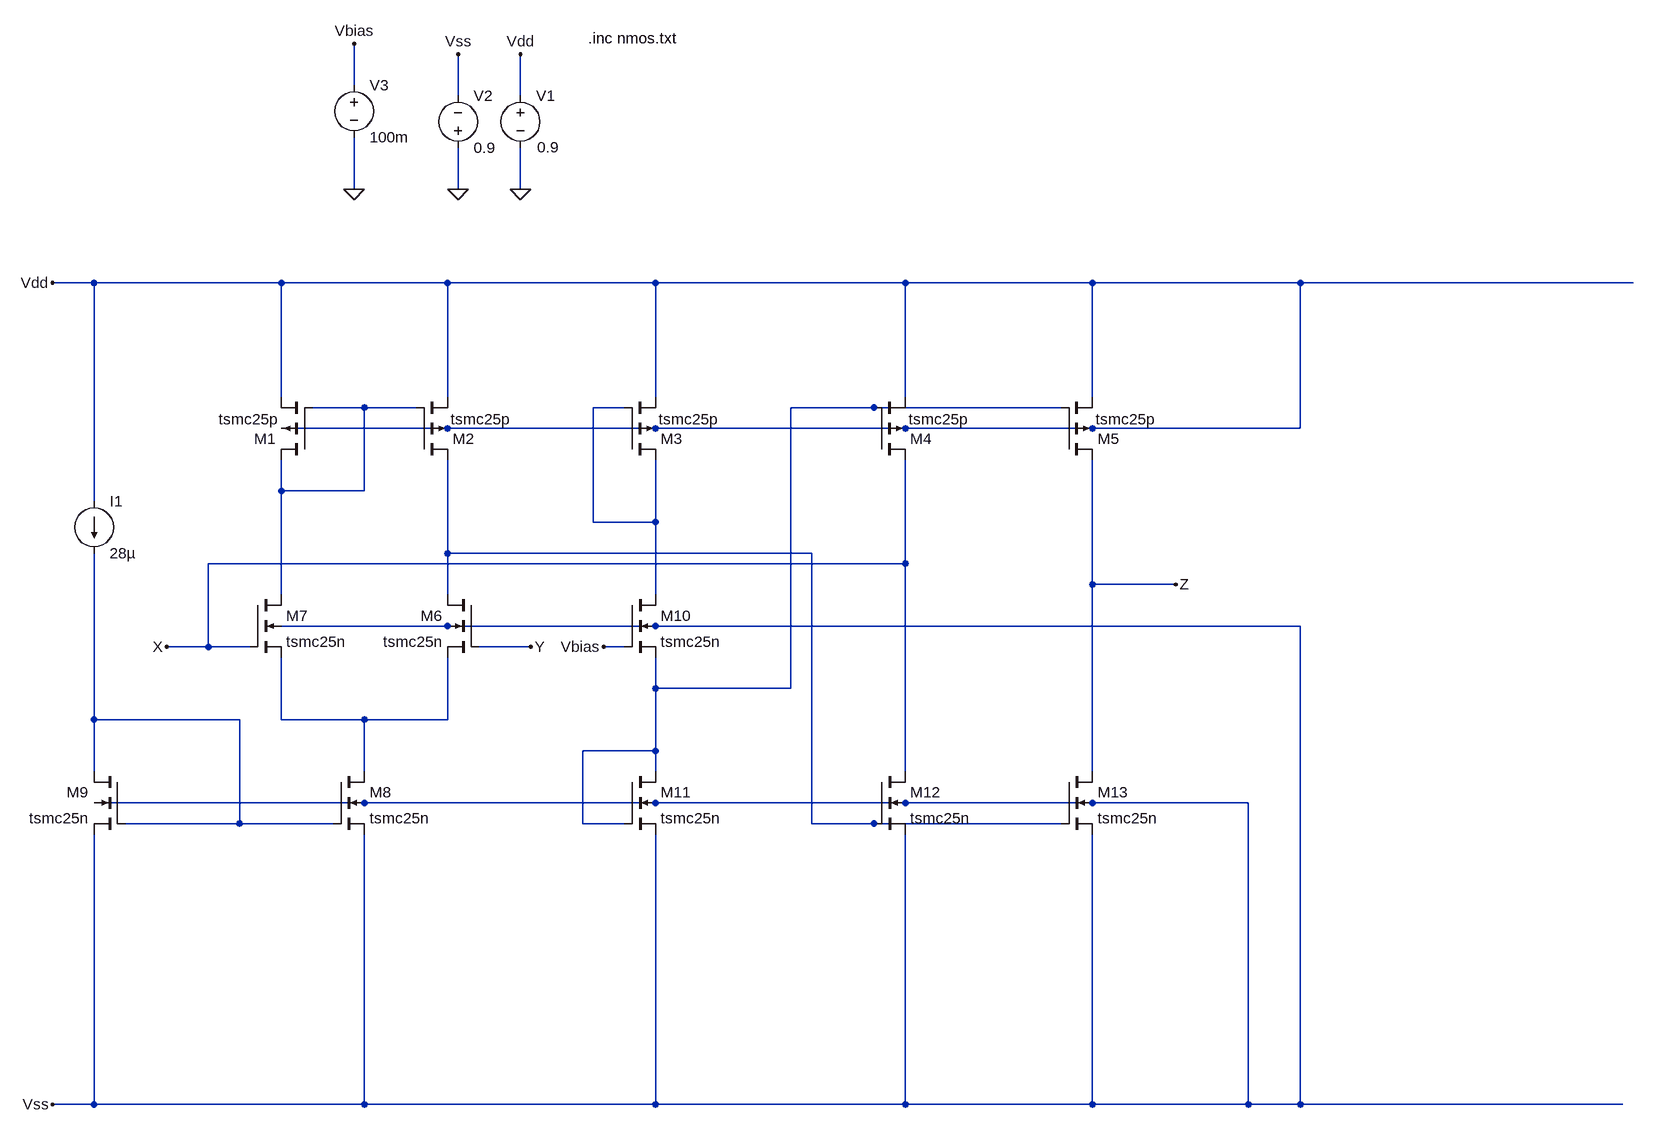
[diagram p0: schematic CCII_3.asc]
CCII_3.asc, the LTspice schematic file:
Version 4
SHEET 1 2612 1744
WIRE -304 96 -304 32
WIRE -144 112 -144 48
WIRE -48 112 -48 48
WIRE -304 256 -304 176
WIRE -144 256 -144 192
WIRE -48 256 -48 192
WIRE -704 400 -768 400
WIRE -416 400 -704 400
WIRE -160 400 -416 400
WIRE 160 400 -160 400
WIRE 544 400 160 400
WIRE 832 400 544 400
WIRE 1152 400 832 400
WIRE 1664 400 1152 400
WIRE -416 576 -416 400
WIRE -160 576 -160 400
WIRE 160 576 160 400
WIRE 544 576 544 400
WIRE 832 576 832 400
WIRE -288 592 -368 592
WIRE -208 592 -288 592
WIRE 112 592 64 592
WIRE 496 592 368 592
WIRE 784 592 496 592
WIRE -160 624 -416 624
WIRE 160 624 -160 624
WIRE 544 624 160 624
WIRE 832 624 544 624
WIRE 1152 624 1152 400
WIRE 1152 624 832 624
WIRE -416 720 -416 672
WIRE -288 720 -288 592
WIRE -288 720 -416 720
WIRE -704 736 -704 400
WIRE 64 768 64 592
WIRE 160 768 160 672
WIRE 160 768 64 768
WIRE -160 816 -160 672
WIRE 400 816 -160 816
WIRE 544 832 544 672
WIRE 544 832 -528 832
WIRE 832 864 832 672
WIRE 960 864 832 864
WIRE -416 880 -416 720
WIRE -160 880 -160 816
WIRE 160 880 160 768
WIRE -160 928 -416 928
WIRE 160 928 -160 928
WIRE 1152 928 160 928
WIRE -528 960 -528 832
WIRE -528 960 -592 960
WIRE -464 960 -528 960
WIRE -32 960 -112 960
WIRE 112 960 80 960
WIRE 160 1024 160 976
WIRE 368 1024 368 592
WIRE 368 1024 160 1024
WIRE -704 1072 -704 816
WIRE -480 1072 -704 1072
WIRE -416 1072 -416 976
WIRE -288 1072 -416 1072
WIRE -160 1072 -160 976
WIRE -160 1072 -288 1072
WIRE 160 1120 160 1024
WIRE 160 1120 48 1120
WIRE -704 1152 -704 1072
WIRE -288 1152 -288 1072
WIRE 160 1152 160 1120
WIRE 544 1152 544 832
WIRE 832 1152 832 864
WIRE -288 1200 -704 1200
WIRE 160 1200 -288 1200
WIRE 544 1200 160 1200
WIRE 832 1200 544 1200
WIRE 1072 1200 832 1200
WIRE -480 1232 -480 1072
WIRE -480 1232 -656 1232
WIRE -336 1232 -480 1232
WIRE 48 1232 48 1120
WIRE 112 1232 48 1232
WIRE 400 1232 400 816
WIRE 496 1232 400 1232
WIRE 784 1232 496 1232
WIRE -704 1664 -704 1248
WIRE -704 1664 -768 1664
WIRE -288 1664 -288 1248
WIRE -288 1664 -704 1664
WIRE 160 1664 160 1248
WIRE 160 1664 -288 1664
WIRE 544 1664 544 1248
WIRE 544 1664 160 1664
WIRE 832 1664 832 1248
WIRE 832 1664 544 1664
WIRE 1072 1664 1072 1200
WIRE 1072 1664 832 1664
WIRE 1152 1664 1152 928
WIRE 1152 1664 1072 1664
WIRE 1648 1664 1152 1664
FLAG -144 256 0
FLAG -48 256 0
FLAG -144 48 Vss
FLAG -48 48 Vdd
FLAG -768 400 Vdd
FLAG -768 1664 Vss
FLAG -592 960 X
FLAG -32 960 Y
FLAG 80 960 Vbias
FLAG 960 864 Z
FLAG -304 32 Vbias
FLAG -304 256 0
SYMBOL voltage -48 96 R0
WINDOW 123 24 124 Left 2
WINDOW 39 0 0 Left 0
WINDOW 3 26 95 Left 2
SYMATTR Value 0.9
SYMATTR InstName V1
SYMBOL voltage -144 208 M180
WINDOW 0 24 96 Left 2
WINDOW 3 24 16 Left 2
WINDOW 123 0 0 Left 0
WINDOW 39 0 0 Left 0
SYMATTR InstName V2
SYMATTR Value 0.9
SYMBOL pmos4 -368 672 R180
WINDOW 3 53 62 Left 2
SYMATTR Value tsmc25p
SYMATTR InstName M1
SYMATTR Value2 l=0.18u w= 5.52u
SYMBOL pmos4 -208 672 M180
WINDOW 3 53 62 Left 2
SYMATTR Value tsmc25p
SYMATTR InstName M2
SYMATTR Value2 l=0.18u w=2u
SYMBOL pmos4 112 672 M180
WINDOW 3 53 62 Left 2
SYMATTR Value tsmc25p
SYMATTR InstName M3
SYMATTR Value2 l=0.18u w=8u
SYMBOL pmos4 496 672 M180
WINDOW 3 53 62 Left 2
SYMATTR Value tsmc25p
SYMATTR InstName M4
SYMATTR Value2 l=0.18u w=8u
SYMBOL pmos4 784 672 M180
WINDOW 3 53 62 Left 2
SYMATTR Value tsmc25p
SYMATTR InstName M5
SYMATTR Value2 l=0.18u w=8u
SYMBOL nmos4 -112 880 M0
SYMATTR InstName M6
SYMATTR Value tsmc25n
SYMATTR Value2 l=0.18u w=0.5u
SYMBOL nmos4 -464 880 R0
SYMATTR InstName M7
SYMATTR Value tsmc25n
SYMATTR Value2 l=0.18u w=2.5u
SYMBOL current -704 736 R0
WINDOW 123 0 0 Left 0
WINDOW 39 0 0 Left 0
SYMATTR InstName I1
SYMATTR Value 28µ
SYMBOL nmos4 -336 1152 R0
SYMATTR InstName M8
SYMATTR Value tsmc25n
SYMATTR Value2 l=0.18u w=4u
SYMBOL nmos4 -656 1152 M0
SYMATTR InstName M9
SYMATTR Value tsmc25n
SYMATTR Value2 l=0.18u w=2.5u
SYMBOL nmos4 112 880 R0
SYMATTR InstName M10
SYMATTR Value tsmc25n
SYMATTR Value2 l=0.18u w=8u
SYMBOL nmos4 112 1152 R0
SYMATTR InstName M11
SYMATTR Value tsmc25n
SYMATTR Value2 l=0.18u w=10u
SYMBOL nmos4 496 1152 R0
SYMATTR InstName M12
SYMATTR Value tsmc25n
SYMATTR Value2 l=0.18u w=10u
SYMBOL nmos4 784 1152 R0
SYMATTR InstName M13
SYMATTR Value tsmc25n
SYMATTR Value2 l=0.18u w=10u
SYMBOL voltage -304 80 R0
WINDOW 123 0 0 Left 0
WINDOW 39 0 0 Left 0
SYMATTR InstName V3
SYMATTR Value 100m
TEXT 56 24 Left 2 !.inc nmos.txt

The netlist it stands for:
* CCII_3.asc
V1 Vdd 0 0.9
V2 0 Vss 0.9
M1 N001 N001 Vdd Vdd tsmc25p l=0.18u w= 5.52u
M2 N004 N001 Vdd Vdd tsmc25p l=0.18u w=2u
M3 N002 N002 Vdd Vdd tsmc25p l=0.18u w=8u
M4 X N003 Vdd Vdd tsmc25p l=0.18u w=8u
M5 Z N003 Vdd Vdd tsmc25p l=0.18u w=8u
M6 N004 Y N006 Vss tsmc25n l=0.18u w=0.5u
M7 N001 X N006 Vss tsmc25n l=0.18u w=2.5u
I1 Vdd N005 28µ
M8 N006 N005 Vss Vss tsmc25n l=0.18u w=4u
M9 N005 N005 Vss Vss tsmc25n l=0.18u w=2.5u
M10 N002 Vbias N003 Vss tsmc25n l=0.18u w=8u
M11 N003 N003 Vss Vss tsmc25n l=0.18u w=10u
M12 X N004 Vss Vss tsmc25n l=0.18u w=10u
M13 Z N004 Vss Vss tsmc25n l=0.18u w=10u
V3 Vbias 0 100m
.model NMOS NMOS
.model PMOS PMOS
.lib standard.mos
.inc nmos.txt
.backanno
.end